# EAGLE design 511_outin_raspberrypi (EAGLE 8.5.1)
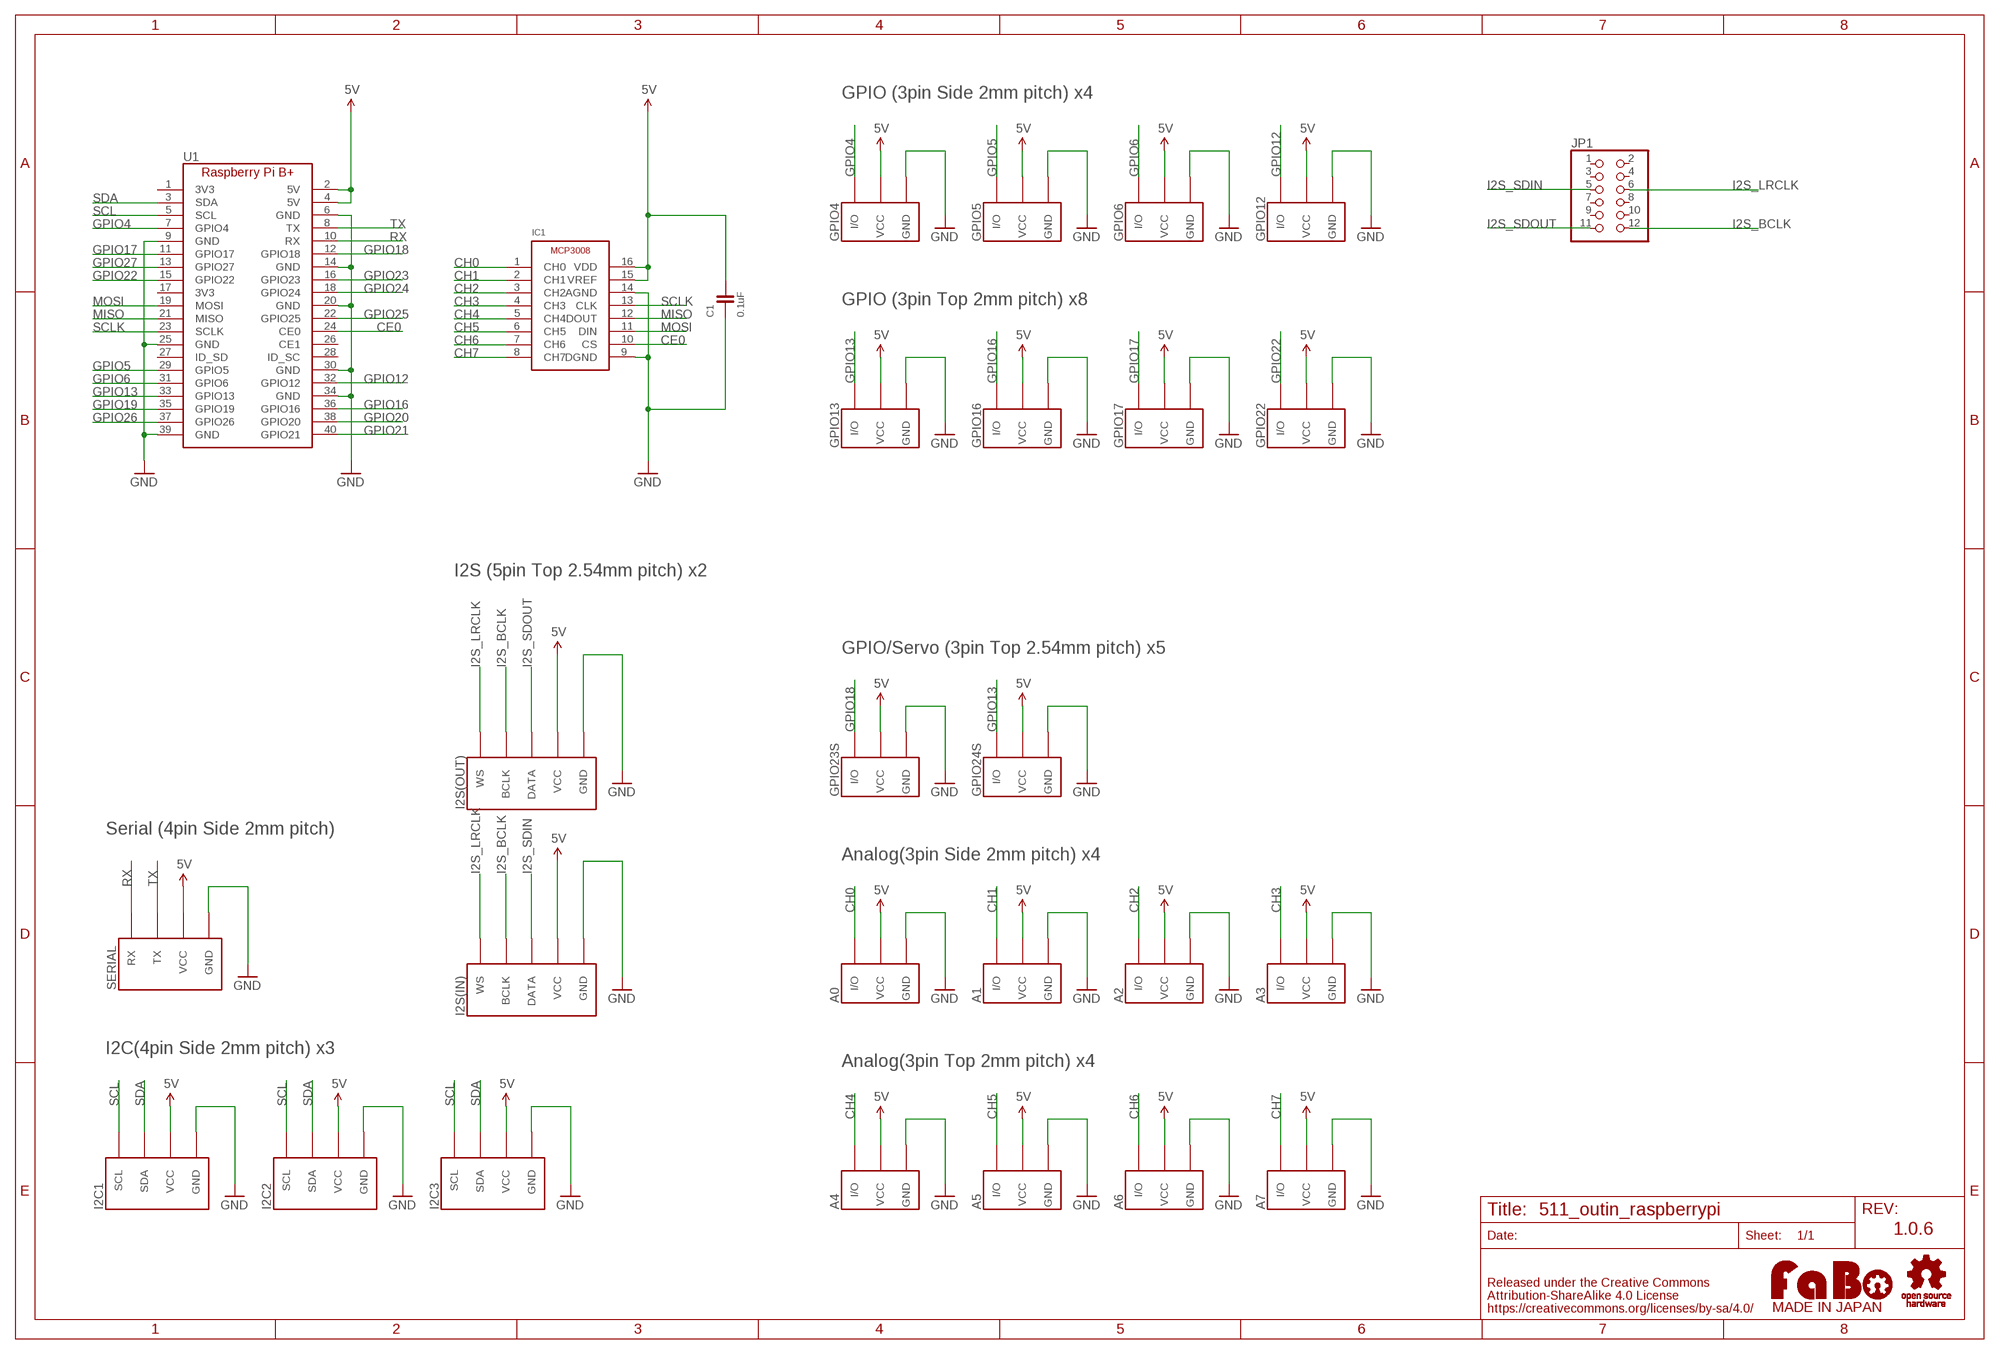
[diagram p0: schematic, sheet 1]

## Parts
A0  FABO_BRICK_3PIN-S03B-PASK-2  [FABO_BRICK_3PIN_S03B-PASK-2]
A1  FABO_BRICK_3PIN-S03B-PASK-2  [FABO_BRICK_3PIN_S03B-PASK-2]
A2  FABO_BRICK_3PIN-S03B-PASK-2  [FABO_BRICK_3PIN_S03B-PASK-2]
A3  FABO_BRICK_3PIN-S03B-PASK-2  [FABO_BRICK_3PIN_S03B-PASK-2]
A4  FABO_BRICK_3PIN-B03B-PASK-1  [FABO_BRICK_3PIN_B03B-PASK-1]
A5  FABO_BRICK_3PIN-B03B-PASK-1  [FABO_BRICK_3PIN_B03B-PASK-1]
A6  FABO_BRICK_3PIN-B03B-PASK-1  [FABO_BRICK_3PIN_B03B-PASK-1]
A7  FABO_BRICK_3PIN-B03B-PASK-1  [FABO_BRICK_3PIN_B03B-PASK-1]
C1  0.1uF  CAPACITOR-0603  [0603]
GPIO4  FABO_BRICK_3PIN-S03B-PASK-2  [FABO_BRICK_3PIN_S03B-PASK-2]
GPIO5  FABO_BRICK_3PIN-S03B-PASK-2  [FABO_BRICK_3PIN_S03B-PASK-2]
GPIO6  FABO_BRICK_3PIN-S03B-PASK-2  [FABO_BRICK_3PIN_S03B-PASK-2]
GPIO12  FABO_BRICK_3PIN-S03B-PASK-2  [FABO_BRICK_3PIN_S03B-PASK-2]
GPIO13  FABO_BRICK_3PIN-B03B-PASK-1  [FABO_BRICK_3PIN_B03B-PASK-1]
GPIO16  FABO_BRICK_3PIN-B03B-PASK-1  [FABO_BRICK_3PIN_B03B-PASK-1]
GPIO17  FABO_BRICK_3PIN-B03B-PASK-1  [FABO_BRICK_3PIN_B03B-PASK-1]
GPIO22  FABO_BRICK_3PIN-B03B-PASK-1  [FABO_BRICK_3PIN_B03B-PASK-1]
GPIO23S  FABO_BRICK_3PIN-HEADER  [FABO_BRICK_3PIN_HEADER]
GPIO24S  FABO_BRICK_3PIN-HEADER  [FABO_BRICK_3PIN_HEADER]
I2C1  FABO_BRICK_I2C-S04B-PASK-2  [FABO_BRICK_I2C_S04B-PASK-2]
I2C2  FABO_BRICK_I2C-S04B-PASK-2  [FABO_BRICK_I2C_S04B-PASK-2]
I2C3  FABO_BRICK_I2C-S04B-PASK-2  [FABO_BRICK_I2C_S04B-PASK-2]
I2S(IN)  FABO_BRICK_I2SLONG  [FABO_BRICK_I2S_S05B-PASK-2_LONG]
I2S(OUT)  FABO_BRICK_I2SLONG  [FABO_BRICK_I2S_S05B-PASK-2_LONG]
IC1  MICROCHIP-MCP3008  [MICROCHIP-MCP3008]
JP1  PINHD-2X6  [2X06]
SERIAL  FABO_BRICK_SERIAL-S04B-PASK-2  [FABO_BRICK_SERIAL_S04B-PASK-2]
U1  RASPBERRY_PI_B+  [RASPBERRY_PI_B+]
U$4  LOGO_OSHW-T_M_BOTTOM  [LOGO_OSHW_T_MS_BOTTOM]
U$14  LOGO_FABO-M  [LOGO_FABO_MS]

## Nets
5V: A0.VCC A1.VCC A2.VCC A3.VCC A4.VCC A5.VCC A6.VCC A7.VCC C1.2 GPIO4.VCC GPIO5.VCC GPIO6.VCC GPIO12.VCC GPIO13.VCC GPIO16.VCC GPIO17.VCC GPIO22.VCC GPIO23S.VCC GPIO24S.VCC I2C1.VCC I2C2.VCC I2C3.VCC I2S(IN).VCC I2S(OUT).VCC IC1.15(VREF) IC1.16(VDD) SERIAL.VCC U1.2(5V) U1.4(5V)
CE0: IC1.10(CS) U1.24(CE0)
CH0: A0.I/O IC1.1(CH0)
CH1: A1.I/O IC1.2(CH1)
CH2: A2.I/O IC1.3(CH2)
CH3: A3.I/O IC1.4(CH3)
CH4: A4.I/O IC1.5(CH4)
CH5: A5.I/O IC1.6(CH5)
CH6: A6.I/O IC1.7(CH6)
CH7: A7.I/O IC1.8(CH7)
GND: A0.GND A1.GND A2.GND A3.GND A4.GND A5.GND A6.GND A7.GND C1.1 GPIO4.GND GPIO5.GND GPIO6.GND GPIO12.GND GPIO13.GND GPIO16.GND GPIO17.GND GPIO22.GND GPIO23S.GND GPIO24S.GND I2C1.GND I2C2.GND I2C3.GND I2S(IN).GND I2S(OUT).GND IC1.9(DGND) IC1.14(AGND) SERIAL.GND U1.6(GND) U1.9(GND) U1.14(GND) U1.20(GND) U1.25(GND) U1.30(GND) U1.34(GND) U1.39(GND)
GPIO4: GPIO4.I/O U1.7(GPIO4)
GPIO5: GPIO5.I/O U1.29(GPIO5)
GPIO6: GPIO6.I/O U1.31(GPIO6)
GPIO12: GPIO12.I/O U1.32(GPIO12)
GPIO13: GPIO13.I/O GPIO24S.I/O U1.33(GPIO13)
GPIO16: GPIO16.I/O U1.36(GPIO16)
GPIO17: GPIO17.I/O U1.11(GPIO17)
GPIO18: GPIO23S.I/O U1.12(GPIO18)
GPIO19: U1.35(GPIO19)
GPIO20: U1.38(GPIO20)
GPIO21: U1.40(GPIO21)
GPIO22: GPIO22.I/O U1.15(GPIO22)
GPIO23: U1.16(GPIO23)
GPIO24: U1.18(GPIO24)
GPIO25: U1.22(GPIO25)
GPIO26: U1.37(GPIO26)
GPIO27: U1.13(GPIO27)
I2S_BCLK: I2S(IN).BCLK I2S(OUT).BCLK JP1.12
I2S_LRCLK: I2S(IN).WS I2S(OUT).WS JP1.6
I2S_SDIN: I2S(IN).DATA JP1.5
I2S_SDOUT: I2S(OUT).DATA JP1.11
MISO: IC1.12(DOUT) U1.21(MISO)
MOSI: IC1.11(DIN) U1.19(MOSI)
RX: SERIAL.RX U1.10(RX)
SCL: I2C1.SCL I2C2.SCL I2C3.SCL U1.5(SCL)
SCLK: IC1.13(CLK) U1.23(SCLK)
SDA: I2C1.SDA I2C2.SDA I2C3.SDA U1.3(SDA)
TX: SERIAL.TX U1.8(TX)
Unconnected: JP1.1 JP1.2 JP1.3 JP1.4 JP1.7 JP1.8 JP1.9 JP1.10 U1.1(3V3) U1.17(3V3) U1.26(CE1) U1.27(ID_SD) U1.28(ID_SC)

## Notes on the sheet
- GPIO (3pin Side 2mm pitch) x4
- GPIO (3pin Top 2mm pitch) x8
- I2S (5pin Top 2.54mm pitch) x2
- GPIO/Servo (3pin Top 2.54mm pitch) x5
- Serial (4pin Side 2mm pitch)
- Analog(3pin Side 2mm pitch) x4
- I2C(4pin Side 2mm pitch) x3
- Analog(3pin Top 2mm pitch) x4
- 1.0.6

## Library data of the parts
A0 A1-A7 GPIO4-GPIO6 GPIO12 GPIO13 GPIO16 GPIO17 GPIO22 GPIO23S GPIO24S = FaBo-Template:FABO_BRICK_3PIN: FaBo Brick 3pin
C1 = FaBo-Capacitor:CAPACITOR: CAPACITOR
I2C1-I2C3 = FaBo-Template:FABO_BRICK_I2C: FaBo Brick I2C
I2S(IN) I2S(OUT) = FaBo-Template:FABO_BRICK_I2S
IC1 = FaBo-ADC:MICROCHIP-MCP3008
JP1 = pinhead:PINHD-2X6: PIN HEADER
SERIAL = FaBo-Template:FABO_BRICK_SERIAL: FaBo Brick Serial
U1 = FaBo-Boards:RASPBERRY_PI_B+
U$4 = FaBo-etc:LOGO_OSHW
U$14 = FaBo-etc:LOGO_FABO

## Board
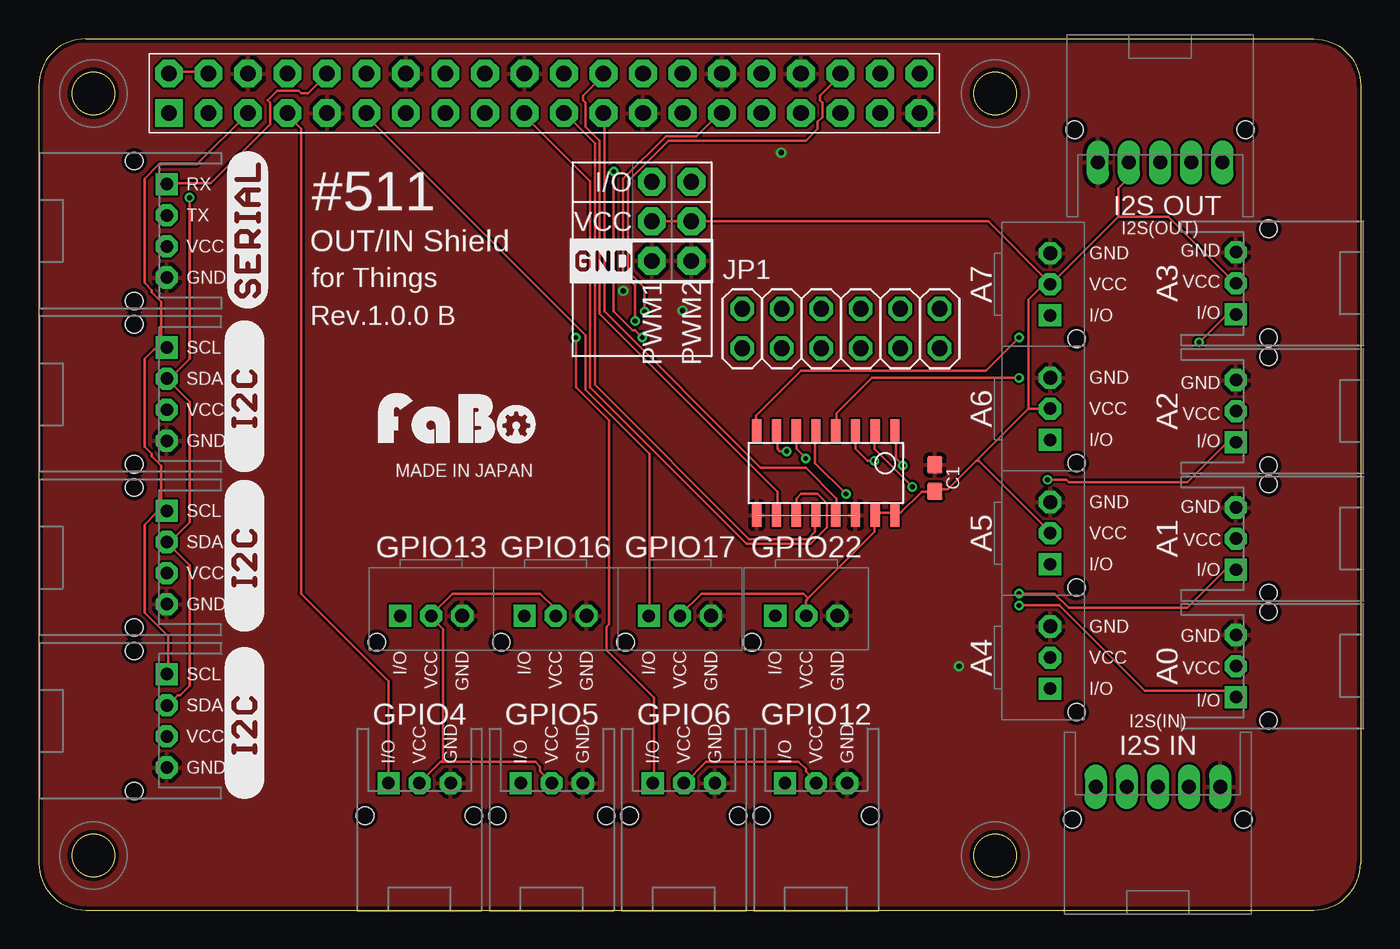
[diagram p1: board, top side]
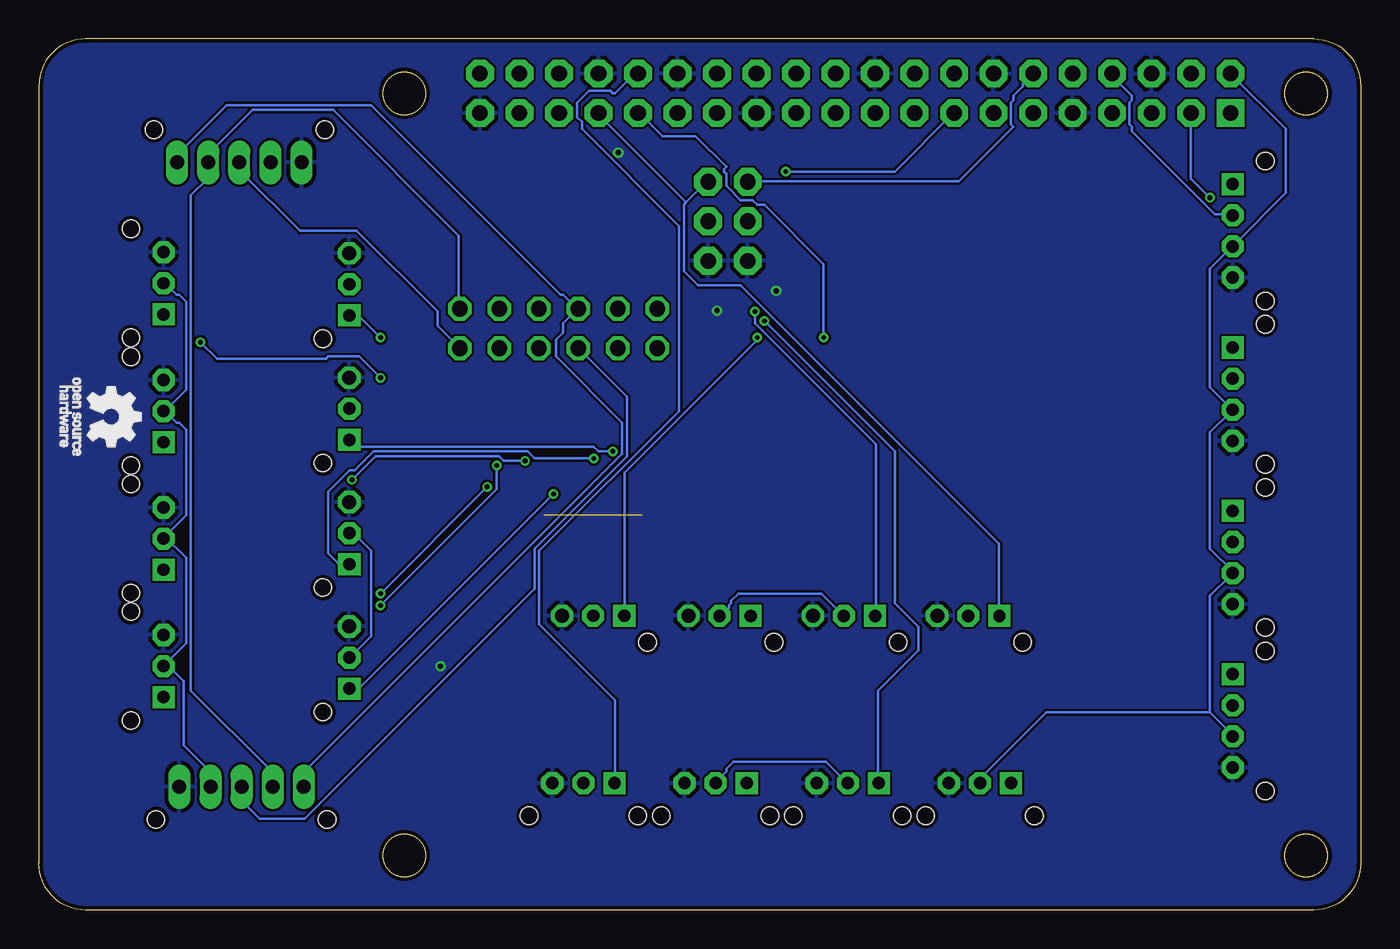
[diagram p2: board, bottom side, seen from below]

Size 85 x 56 mm. Coordinates in mm from the lower left corner, seen from the top.
Copper layers (1*16): Top 0.035mm / dielectric 1.5mm / Bottom 0.035mm
Design rules "Elecrow_2-layer_eagle_rule": minimum track width 6mil, minimum drill 12mil, track to track 6mil, track to pad 6mil, pad to pad 6mil, via to via 6mil, smd to smd 0mil, copper to edge 10mil, drill to drill 10mil, minimum pad ring 10mil, minimum via ring 6mil, stop-mask expansion 2mil, vias tented up to drill 100mil, thermal gap 10mil

### Footprints (pad centres in the part's own frame; a part is rotated, then mirrored left to right if it is on the bottom)
FABO_BRICK_3PIN_S03B-PASK-2 = drill 0.8 pad 1.422 octagon: GND -2,0; VCC 0,0 | drill 0.8 pad 1.422 square: I/O 2,0 | hole 1.1: 3.5,2.1; -3.5,2.1
FABO_BRICK_3PIN_B03B-PASK-1 = drill 0.9 pad 1.422 octagon: GND -2,0 | drill 0.8 pad 1.422 square: I/O 2,0 | drill 0.8 pad 1.422 octagon: VCC 0,0 | hole 1.1: 3.5,1.7
0603 = smd 1.1 x 1: 1 -0.85,0; 2 0.85,0
FABO_BRICK_3PIN_HEADER = drill 1 pad 1.778 octagon: GND -2.54,0; I/O 2.54,0; VCC 0,0
FABO_BRICK_I2C_S04B-PASK-2 = drill 0.8 pad 1.422 octagon: GND -3,0; SDA 1,0; VCC -1,0 | drill 0.8 pad 1.422 square: SCL 3,0 | hole 1.1: 4.5,2.1; -4.5,2.1
FABO_BRICK_I2S_S05B-PASK-2_LONG = drill 0.9 pad 1.422 long: BCLK 3,0; DATA 1,0; GND -3,0; VCC -1,0; WS 5,0 | hole 1.1: 6.5,2.1; -4.5,2.1
MICROCHIP-MCP3008 = smd 0.6 x 1.5: 1 -4.445,-2.7; 2 -3.175,-2.7; 3 -1.905,-2.7; 4 -0.635,-2.7; 5 0.635,-2.7; 6 1.905,-2.7; 7 3.175,-2.7; 8 4.445,-2.7; 9 4.445,2.7; 10 3.175,2.7; 11 1.905,2.7; 12 0.635,2.7; 13 -0.635,2.7; 14 -1.905,2.7; 15 -3.175,2.7; 16 -4.445,2.7
2X06 = drill 1.016 octagon: 1 -6.35,-1.27; 2 -6.35,1.27; 3 -3.81,-1.27; 4 -3.81,1.27; 5 -1.27,-1.27; 6 -1.27,1.27; 7 1.27,-1.27; 8 1.27,1.27; 9 3.81,-1.27; 10 3.81,1.27; 11 6.35,-1.27; 12 6.35,1.27
FABO_BRICK_SERIAL_S04B-PASK-2 = drill 0.8 pad 1.422 octagon: GND -3,0; TX 1,0; VCC -1,0 | drill 0.8 pad 1.422 square: RX 3,0 | hole 1.1: 4.5,2.1; -4.5,2.1
RASPBERRY_PI_B+ = drill 1 pad 1.778 square: 1 0,-2.54 | drill 1 pad 1.778 octagon: 2 0,0; 3 2.54,-2.54; 4 2.54,0; 5 5.08,-2.54; 6 5.08,0; 7 7.62,-2.54; 8 7.62,0; 9 10.16,-2.54; 10 10.16,0; 11 12.7,-2.54; 12 12.7,0; 13 15.24,-2.54; 14 15.24,0; 15 17.78,-2.54; 16 17.78,0; 17 20.32,-2.54; 18 20.32,0; 19 22.86,-2.54; 20 22.86,0; 21 25.4,-2.54; 22 25.4,0; 23 27.94,-2.54; 24 27.94,0; 25 30.48,-2.54; 26 30.48,0; 27 33.02,-2.54; 28 33.02,0; 29 35.56,-2.54; 30 35.56,0; 31 38.1,-2.54; 32 38.1,0; 33 40.64,-2.54; 34 40.64,0; 35 43.18,-2.54; 36 43.18,0; 37 45.72,-2.54; 38 45.72,0; 39 48.26,-2.54; 40 48.26,0

### Placement (x,y rotation side)
A0  76.98,15.68 270 top
A1  76.98,23.88 270 top
A2  76.98,32.07 270 top
A3  76.98,40.29 270 top
A4  65.03,16.23 270 top
A5  65.03,24.23 270 top
A6  65.03,32.23 270 top
A7  65.03,40.23 270 top
C1  57.62,27.76 270 top
GPIO4  24.48,8.16 180 top
GPIO5  32.98,8.16 180 top
GPIO6  41.48,8.16 180 top
GPIO12  49.98,8.16 180 top
GPIO13  25.23,18.91 180 top
GPIO16  33.23,18.91 180 top
GPIO17  41.23,18.91 180 top
GPIO22  49.36,18.92 180 top
GPIO23S  39.42,44.28 90 top
GPIO24S  41.96,44.28 90 top
I2C1  8.23,33.16 90 top
I2C2  8.23,22.66 90 top
I2C3  8.23,12.16 90 top
I2S(IN)  72.96,7.92 180 top
I2S(OUT)  71.11,48.06 0 top
IC1  50.61,28.09 180 top
JP1  51.58,37.38 0 top
SERIAL  8.23,43.66 90 top
U1  8.37,53.77 0 top
U$2  [LOGO_SILK_I2C]  14.48,17.91 90 top
U$3  [LOGO_SILK_SERIAL2]  14.73,38.66 90 top
U$4  80.38,31.7 90 top
U$5  [LOGO_SILK_I2C]  14.48,7.16 90 top
U$6  [LOGO_SILK_I2C]  14.48,28.16 90 top
U$7  [LOGO_SILK_GND]  34.34,40.47 0 top
U$14  26.89,29.61 0 top

### Tracks (layer width: path | path; a pad name or v marks a point on that pad's centre or on a via)
5V
  Top 0.152: GPIO23S.VCC 39.56,44.27 41.85,44.27 GPIO24S.VCC 42,44.27 61.05,44.27 64.86,40.46 | 69.43,44.58 65.16,40.31 A7.VCC | 69.43,44.58 69.43,46.4 70.04,47.01 70.04,47.93 I2S(OUT).VCC | 69.43,44.58 72.63,44.58 76.9,40.31 A3.VCC | 64.86,40.46 65.01,40.31 A7.VCC | U1.2 8.47,53.87 10.91,53.87 U1.4 | 26,9.52 31.94,9.52 32.25,9.22 32.25,8.91 32.86,8.3 GPIO5.VCC | 26,9.52 25.84,9.52 24.63,8.3 GPIO4.VCC | GPIO12.VCC 49.92,8.3 49.31,8.91 49.31,9.07 48.86,9.52 42.91,9.52 41.54,8.15 GPIO6.VCC | GPIO16.VCC 33.16,18.97 33.16,19.43 32.25,20.34 26.61,20.34 25.24,18.97 GPIO13.VCC 25.24,18.82 26,18.06 26,9.52 | 49.47,20.04 53.73,24.31 53.73,25.37 IC1.15 53.89,25.53 54.95,25.53 IC1.16 55.11,25.53 55.41,25.53 56.78,26.9 57.54,26.9 C1.2 57.7,27.05 58.46,27.05 60.29,28.88 | 49.47,20.04 49.31,19.89 49.31,18.97 GPIO22.VCC | 63.64,32.23 65.01,32.23 A6.VCC | 60.29,28.88 63.64,32.23 | 60.29,28.88 60.44,28.88 65.01,24.31 A5.VCC | 49.47,20.04 49.16,20.34 42.61,20.34 41.24,18.97 GPIO17.VCC | 64.86,40.46 63.64,39.24 63.64,32.23 | 64.86,40.46 A7.VCC
  Bottom 0.152: I2S(IN).VCC 74,8 74,8.91 75.68,10.59 75.68,14.71 76.59,15.62 76.9,15.62 A0.VCC 76.9,15.77 75.53,17.14 75.53,22.63 76.9,24 | 76.9,24 75.53,25.37 75.53,30.86 75.98,31.32 76.14,31.32 76.9,32.08 | 76.9,32.08 75.53,33.45 75.53,39.09 75.98,39.55 76.14,39.55 76.9,40.31 A3.VCC | 76.9,32.08 A2.VCC | 76.9,24 A1.VCC | 9.69,12.72 8.62,11.66 8.62,11.5 8.32,11.2 I2C3.VCC | 9.69,12.72 9.69,20.19 8.32,21.56 I2C2.VCC 8.17,21.72 9.69,23.24 9.69,30.71 8.32,32.08 I2C1.VCC 8.32,32.23 9.69,33.6 9.69,41.22 8.32,42.59 SERIAL.VCC 8.17,42.75 4.81,46.1 4.81,50.21 U1.2 | GPIO6.VCC 41.39,8.3 40.78,8.91 40.78,9.07 40.32,9.52 34.38,9.52 33.01,8.15 GPIO5.VCC | GPIO17.VCC 41.08,18.97 40.63,19.43 40.63,19.58 40.48,19.73 40.48,19.89 40.02,20.34 34.68,20.34 33.31,18.97 GPIO16.VCC | A4.VCC 65.01,16.23 63.64,17.6 63.64,23.09 64.71,24.15 65.01,24.15 A5.VCC | 9.69,12.72 20.21,12.72 24.63,8.3 GPIO4.VCC
CE0
  Top 0.152: IC1.10 47.49,25.53 47.49,26.9 36.06,38.33 36.06,49.45 35.14,50.37 35.14,51.89 34.99,52.04 34.99,52.35 36.36,53.72 U1.24
CH0  (via drill 0.3)
  Top 0.152: v55.56,28.57 55.11,29.03 55.11,30.71 IC1.1 | v63.03,19.58 65.62,19.58 71.11,14.1 76.59,14.1 76.9,13.79 A0.I/O
  Bottom 0.152: v55.56,28.57 55.56,27.05 v63.03,19.58
CH1  (via drill 0.3)
  Top 0.152: v56.17,27.2 53.73,29.64 53.73,30.71 IC1.2 | v63.03,20.34 65.32,20.34 66.23,19.43 73.85,19.43 76.29,21.87 76.9,21.87 A1.I/O
  Bottom 0.152: v63.03,20.34 v56.17,27.2
CH2  (via drill 0.3)
  Top 0.152: IC1.3 52.51,29.64 53.28,28.88 v53.73,28.88 | v64.86,27.66 66.08,27.66 66.23,27.51 73.85,27.51 76.29,29.95 76.9,29.95 A2.I/O
  Bottom 0.152: v53.73,28.88 55.11,28.88 55.41,29.18 63.34,29.18 v64.86,27.66
CH3  (via drill 0.3)
  Top 0.152: v63.03,34.21 53.58,34.21 51.3,31.93 51.3,30.86 IC1.4 | v74.61,36.5 76.29,38.17 76.9,38.17 A3.I/O
  Bottom 0.152: v63.03,34.21 64.4,35.58 66.38,35.58 66.54,35.43 73.55,35.43 v74.61,36.5
CH4  (via drill 0.3)
  Top 0.152: v51.91,26.74 49.92,28.73 49.92,30.71 IC1.5
  Bottom 0.152: v51.91,26.74 64.4,14.25 65.01,14.25 A4.I/O
CH5  (via drill 0.3)
  Top 0.152: IC1.6 48.7,29.64 v49.31,29.03
  Bottom 0.152: v49.31,29.03 53.12,29.03 53.58,29.49 63.49,29.49 64.71,28.27 65.01,28.27 66.38,26.9 66.38,22.93 65.77,22.33 65.16,22.33 A5.I/O
CH6  (via drill 0.3)
  Top 0.152: v48.1,29.49 47.64,29.49 47.49,29.64 47.49,30.71 IC1.7
  Bottom 0.152: v48.1,29.49 49.01,29.49 49.31,29.79 64.71,29.79 65.01,30.1 A6.I/O
CH7  (via drill 0.3)
  Top 0.152: v63.03,36.8 60.9,34.67 49.01,34.67 46.11,31.77 46.11,30.86 IC1.8
  Bottom 0.152: v63.03,36.8 64.4,38.17 65.01,38.17 A7.I/O
GND  (via drill 0.35)  (1 unrouted)
  other vias: 41.39,38.53 59.17,15.67 47.74,48.69 37.58,39.8
  pour Bottom: -0.52,-0.84 85.48,-0.84 85.48,56.16 -0.52,56.16
  pour Top: -0.52,-0.84 85.48,-0.84 85.48,56.16 -0.52,56.16
GPIO4
  Top 0.152: GPIO4.I/O 22.49,8.3 22.49,14.71 16.85,20.34 16.85,50.21 15.94,51.13 U1.7
GPIO5  (via drill 0.3)
  Top 0.152: v38.34,37.87 38.34,40.16 37.58,40.92 37.58,47.01 40.32,49.76 42.3,49.76 43.83,51.28 U1.29
  Bottom 0.152: v38.34,37.87 29.96,29.49 29.96,19.73 28.44,18.21 28.44,16.69 31.03,14.1 31.03,8.3 GPIO5.I/O
GPIO6  (via drill 0.3)
  Top 0.152: v34.53,36.8 34.53,33.6 36.67,31.47 36.67,18.36 36.51,18.21 36.51,16.69 39.56,13.64 39.56,8.3 GPIO6.I/O
  Bottom 0.152: v34.53,36.8 34.53,41.53 38.34,45.34 38.8,45.34 39.1,45.64 39.87,45.64 40.78,46.56 40.78,47.32 40.93,47.47 40.93,47.62 40.78,47.78 42.76,49.76 44.89,49.76 46.42,51.28 U1.31
GPIO12
  Bottom 0.152: GPIO12.I/O 47.94,8.3 47.94,13.49 52.82,18.36 52.82,23.09 43.83,32.08 43.83,43.97 50.08,50.21 50.08,50.67 50.38,50.98 50.38,51.89 49.62,52.65 48.25,52.65 48.1,52.5 47.94,52.5 46.57,53.87 U1.32
GPIO13
  Bottom 0.152: 43.37,45.49 42,46.86 GPIO24S.I/O | 43.37,45.49 43.52,45.34 43.52,41.07 42.61,40.16 39.87,40.16 23.25,23.54 23.25,18.97 GPIO13.I/O | 43.37,45.49 49.01,51.13 U1.33
GPIO16  (via drill 0.3)
  Top 0.152: v38.95,38.48 38.95,40 37.88,41.07 37.88,46.86 40.48,49.45 49.31,49.45 50.08,50.21 50.08,50.67 50.38,50.98 50.38,51.89 50.23,52.04 50.23,52.35 51.6,53.72 U1.36
  Bottom 0.152: v38.95,38.48 38.95,37.72 31.18,29.95 31.18,18.97 GPIO16.I/O
GPIO17
  Top 0.152: GPIO17.I/O 39.26,18.97 39.26,29.34 35.14,33.45 35.14,36.96 20.97,51.13 U1.11
GPIO18
  Bottom 0.152: U1.12 21.73,53.11 21.73,52.96 22.34,52.35 22.34,52.04 22.49,51.89 22.49,50.52 22.34,50.37 25.84,46.86 39.41,46.86 GPIO23S.I/O
GPIO22  (via drill 0.3)
  Top 0.152: v38.8,36.8 38.34,37.26 38.19,37.26 36.97,38.48 v36.97,47.47
  Bottom 0.152: v38.8,36.8 38.8,36.65 47.33,28.12 47.33,18.97 GPIO22.I/O | v36.97,47.47 29.96,47.47 26.15,51.28 U1.15
I2S_BCLK
  Bottom 0.152: I2S(IN).BCLK 70.04,8 70.04,8.91 75.22,14.1 75.22,45.95 74.16,47.01 74.16,47.93 I2S(OUT).BCLK 74,48.08 74,48.69 71.26,51.43 66.08,51.43 58,43.36 58,38.78 JP1.12
I2S_LRCLK
  Bottom 0.152: 50.38,38.63 51.3,37.72 51.3,37.11 51.75,36.65 51.75,35.58 47.49,31.32 47.49,29.34 67.91,8.91 67.91,8 I2S(IN).WS | 50.38,38.63 51.3,39.55 51.45,39.55 63.64,51.74 72.94,51.74 75.98,48.69 75.98,48.08 I2S(OUT).WS | 50.38,38.63 JP1.6
I2S_SDIN
  Bottom 0.152: I2S(IN).DATA 71.87,7.85 71.87,6.93 70.8,5.87 67.91,5.87 53.12,20.65 53.12,23.24 47.18,29.18 47.18,32.99 50.23,36.04 JP1.5
I2S_SDOUT
  Bottom 0.152: I2S(OUT).DATA 72.02,47.93 72.02,47.47 68.21,43.66 64.56,43.66 59.37,38.48 59.37,37.57 58,36.19 JP1.11
MISO
  Top 0.152: IC1.12 49.92,25.37 49.92,24.31 49.47,23.85 45.66,23.85 35.75,33.76 35.75,49.3 33.77,51.28 U1.21
MOSI
  Top 0.152: IC1.11 48.7,26.44 49.01,26.74 50.08,26.74 50.69,26.14 50.69,24.61 49.62,23.54 45.5,23.54 35.45,33.6 35.45,46.86 31.18,51.13 U1.19
RX
  Top 0.152: SERIAL.RX 8.32,46.71 11.06,46.71 14.87,50.52 14.87,51.89 14.72,52.04 15.33,52.65 16.7,52.65 16.85,52.5 17.31,52.5 18.53,53.72 U1.10
SCL
  Top 0.152: 7.86,25.53 8.17,25.53 I2C2.SCL 7.86,25.53 | 7.86,25.53 7.56,25.53 6.79,24.76 6.79,19.12 8.32,17.6 8.32,15.16 I2C3.SCL | 7.86,36.04 7.4,36.04 6.79,35.43 6.79,29.79 7.25,29.34 7.25,29.18 7.86,28.57 7.86,25.53 | 7.86,36.04 8.17,36.04 I2C1.SCL 7.86,36.04 | U1.5 10.15,47.93 7.71,47.93 6.79,47.01 6.79,40.31 7.25,39.85 7.25,39.7 7.86,39.09 7.86,36.04
SCLK
  Top 0.152: IC1.13 51.3,25.53 51.3,26.44 49.31,28.42 46.42,28.42 36.36,38.48 36.36,51.13 U1.23
SDA  (via drill 0.3)
  Top 0.152: 8.32,23.54 9.69,22.17 9.69,14.4 9.08,13.79 8.93,13.79 8.32,13.18 I2C3.SDA | 8.32,34.06 9.69,32.69 9.69,24.92 8.32,23.54 | 8.32,23.54 I2C2.SDA | v9.69,45.79 9.69,35.43 8.32,34.06 | 8.32,34.06 I2C1.SDA
  Bottom 0.152: U1.3 10.91,47.01 v9.69,45.79
TX
  Bottom 0.152: SERIAL.TX 8.32,44.73 9.39,44.73 14.72,50.06 14.72,50.37 14.87,50.52 14.87,51.89 14.72,52.04 14.72,52.35 16.09,53.72 U1.8

### Text on the board
tPlace: RX | I/O | TX | #511 | I2S OUT | VCC | VCC | OUT/IN Shield | GND | GND | GND | for Things | PWM1 | PWM2 | VCC | VCC | I/O | I/O | Rev.1.0.0 B | SCL | SDA | GND | GND | VCC | VCC | VCC | GND | I/O | I/O | MADE IN JAPAN | GND | GND | SCL | VCC | VCC | SDA | I/O | I/O | VCC | GND | GND | I/O | VCC | GND | I/O | VCC | GND | I/O | VCC | GND | I/O | VCC | GND | GND | VCC | SCL | VCC | I/O | SDA | I/O | VCC | I2S IN | GND | I/O | VCC | GND | I/O | VCC | GND | I/O | VCC | GND | I/O | VCC | GND